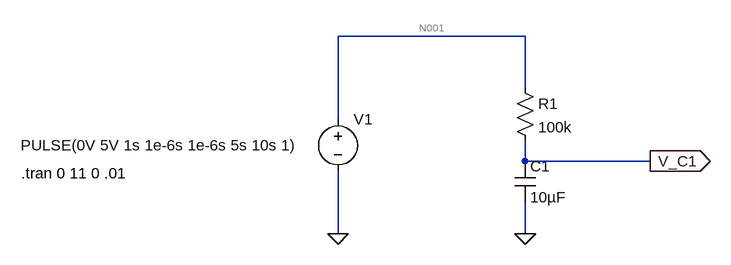
[diagram p0: schematic capacitor_charge_discharge_V001.asc]
capacitor_charge_discharge_V001.asc, the LTspice schematic file:
Version 4
SHEET 1 880 680
WIRE 240 -16 -48 -16
WIRE 240 64 240 -16
WIRE -48 112 -48 -16
WIRE 240 176 240 144
WIRE 432 176 240 176
WIRE -48 288 -48 192
WIRE 240 288 240 240
FLAG 240 288 0
FLAG -48 288 0
FLAG 432 176 V_C1
IOPIN 432 176 Out
SYMBOL cap 224 176 R0
SYMATTR InstName C1
SYMATTR Value 10µF
SYMBOL res 224 48 R0
SYMATTR InstName R1
SYMATTR Value 100k
SYMBOL voltage -48 96 R0
WINDOW 3 -488 56 Left 2
WINDOW 123 0 0 Left 0
WINDOW 39 0 0 Left 0
SYMATTR InstName V1
SYMATTR Value PULSE(0V 5V 1s 1e-6s 1e-6s 5s 10s 1)
TEXT -535 195 Left 2 !.tran 0 11 0 .01

The netlist it stands for:
* capacitor_charge_discharge_V001.asc
C1 V_C1 0 10µF
R1 N001 V_C1 100k
V1 N001 0 PULSE(0V 5V 1s 1e-6s 1e-6s 5s 10s 1)
.tran 0 11 0 .01
.backanno
.end

* Results of the author's LTspice run, read from the files saved beside the schematic
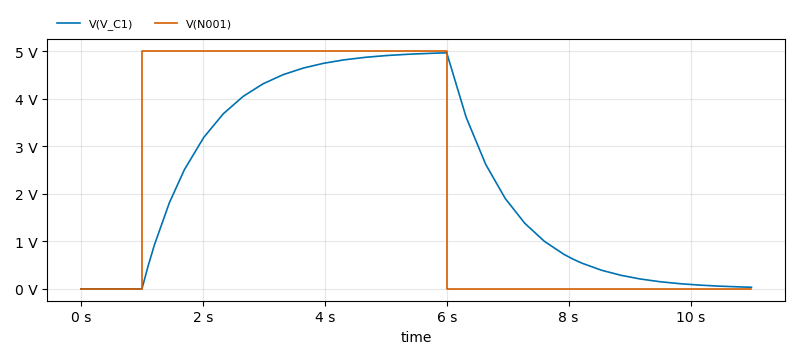
[diagram p1: Transient Analysis of capacitor_charge_discharge_V001.asc, plotted from the saved traces]
* Transient Analysis, 1 run:
*   V(V_C1): min 0 V, max 4.966 V, average 2.271 V, rms 3.023 V, last 33.46 mV
*   V(N001): min 0 V, max 5 V, average 2.273 V, rms 3.371 V, last 0 V